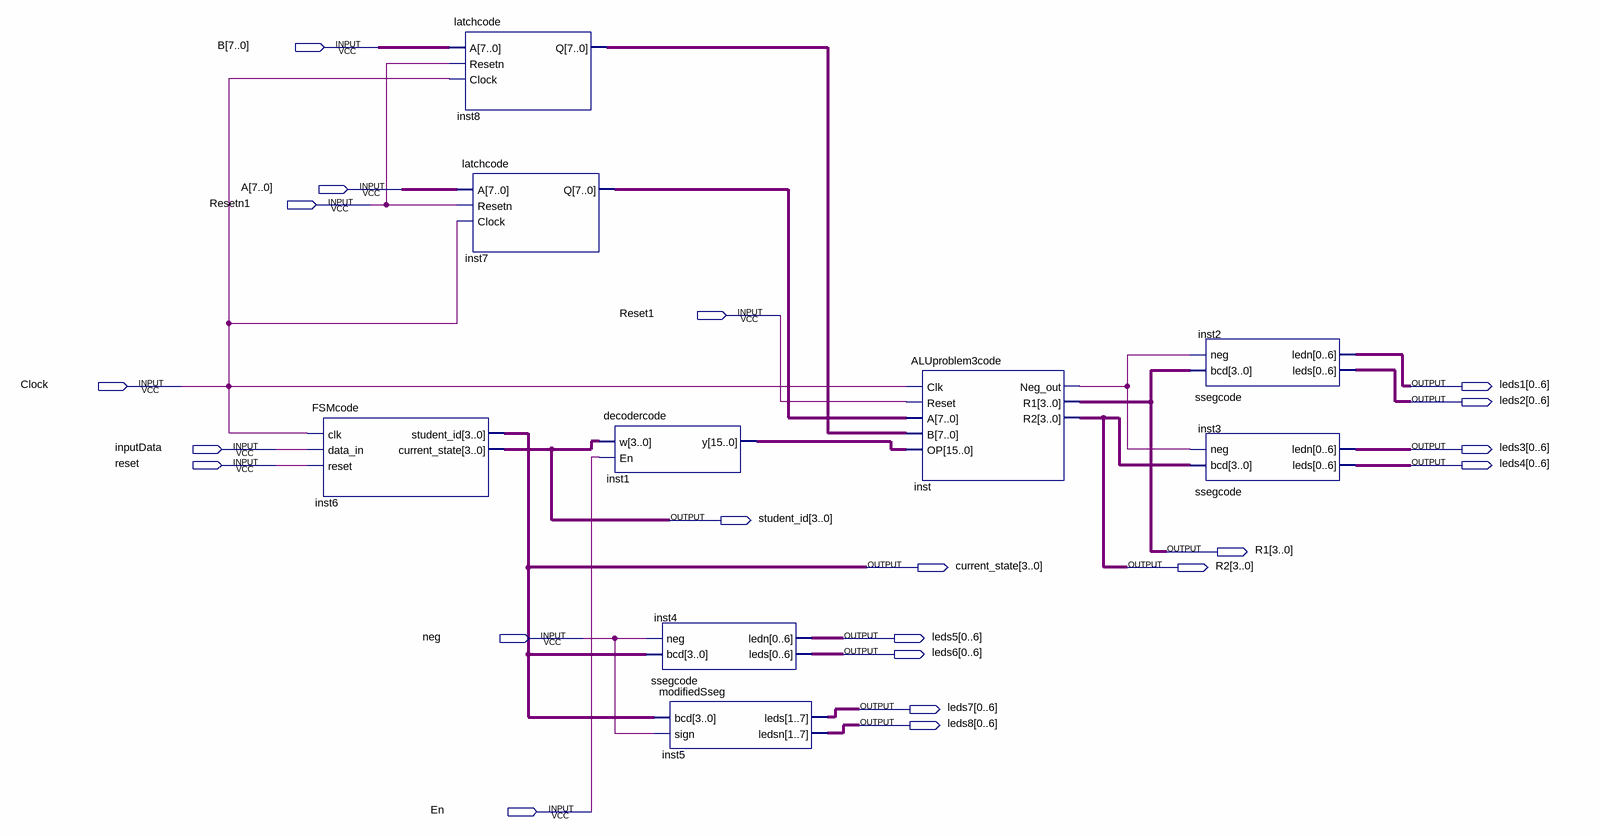
[diagram p0: schematic sheet]
// Quartus schematic ALUproblem3schem.bdf as structural Verilog: 9 symbols, 21 pins
module ALUproblem3schem (
  input  [7:0] B,
  input  [7:0] A,
  input  Resetn1,
  input  Reset1,
  input  Clock,
  input  inputData,
  input  reset,
  input  neg,
  input  En,
  output [0:6] leds1,
  output [0:6] leds2,
  output [0:6] leds3,
  output [0:6] leds4,
  output [3:0] student_id,
  output [3:0] R1,
  output [3:0] current_state,
  output [3:0] R2,
  output [0:6] leds5,
  output [0:6] leds6,
  output [0:6] leds7,
  output [0:6] leds8
);

  wire inst_neg_out;
  wire [7:0] inst7_q, inst8_q;
  wire [15:0] inst1_y;

  FSMcode inst6 (
    .clk(Clock), .data_in(inputData), .reset(reset), .student_id(current_state), .current_state(student_id));
  latchcode inst8 (.A(B), .Resetn(Resetn1), .Clock(Clock), .Q(inst8_q));
  latchcode inst7 (.A(A), .Resetn(Resetn1), .Clock(Clock), .Q(inst7_q));
  decodercode inst1 (.w(student_id), .En(En), .y(inst1_y));
  ssegcode inst4 (.bcd(current_state), .neg(neg), .leds(leds6), .ledn(leds5));
  modifiedSseg inst5 (.bcd(current_state), .sign(neg), .leds(leds7), .ledsn(leds8));
  ALUproblem3code inst (
    .Clk(Clock), .Reset(Reset1), .A(inst7_q), .B(inst8_q), .OP(inst1_y), .Neg_out(inst_neg_out), .R1(R1),
    .R2(R2));
  ssegcode inst2 (.bcd(R1), .neg(inst_neg_out), .leds(leds2), .ledn(leds1));
  ssegcode inst3 (.bcd(R2), .neg(inst_neg_out), .leds(leds4), .ledn(leds3));
endmodule
